# EAGLE schematic LPC11UxxMini (EAGLE 6.3)
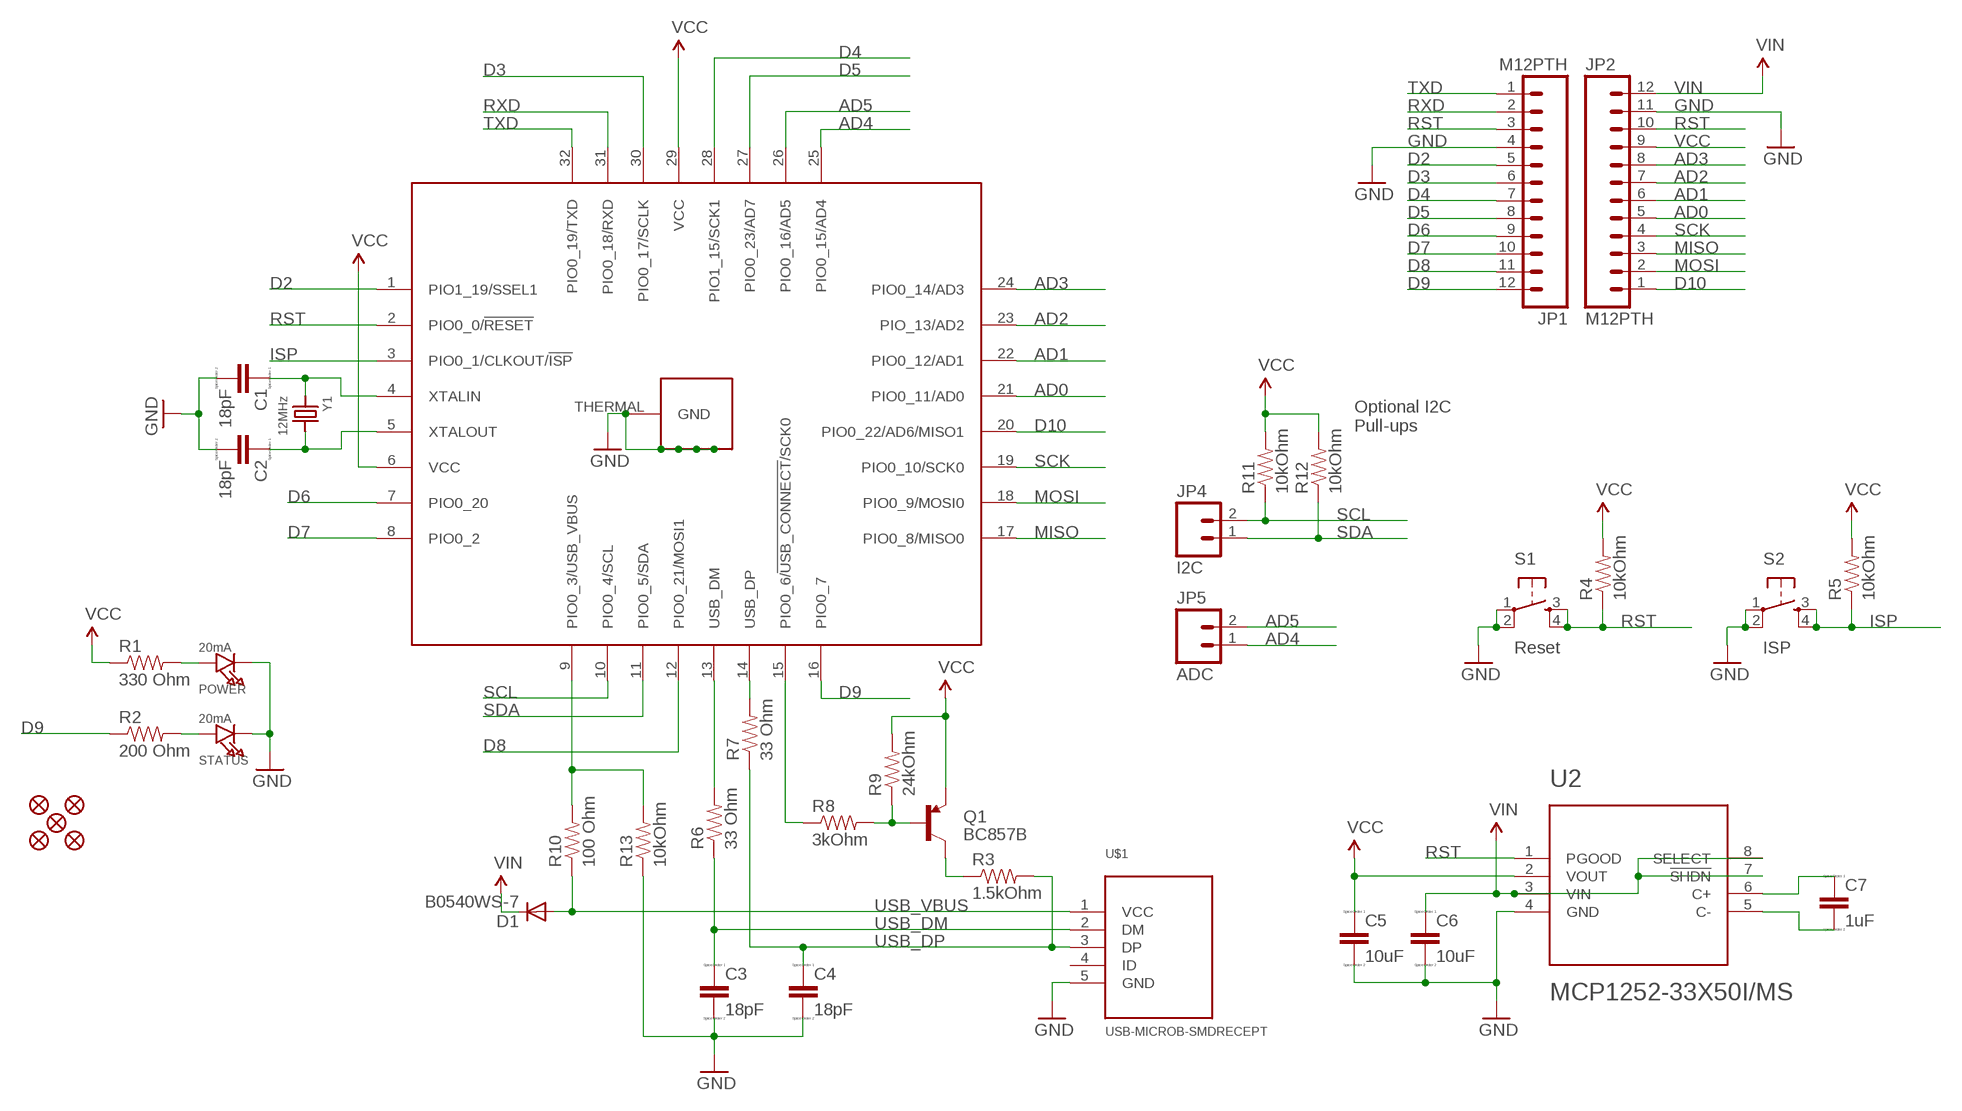
[diagram p0: schematic, sheet 1]

## Parts
C1  18pF  CAP0603-CAP  [0603-CAP]
C2  18pF  CAP0603-CAP  [0603-CAP]
C3  18pF  CAP0603-CAP  [0603-CAP]
C4  18pF  CAP0603-CAP  [0603-CAP]
C5  10uF  CAP1206  [1206]
C6  10uF  CAP1206  [1206]
C7  1uF  CAP0805  [0805]
D1  B0540WS-7  DIODESOD  [SOD-323]
JP1  M12PTH  [1X12]
JP2  M12PTH  [1X12]
JP3  FIDUCIALUFIDUCIAL  [MICRO-FIDUCIAL]
JP4  I2C  M02PTH  [1X02]
JP5  ADC  M02PTH  [1X02]
JP6  FIDUCIALUFIDUCIAL  [MICRO-FIDUCIAL]
JP7  FIDUCIALUFIDUCIAL  [MICRO-FIDUCIAL]
JP8  FIDUCIALUFIDUCIAL  [MICRO-FIDUCIAL]
JP9  FIDUCIALUFIDUCIAL  [MICRO-FIDUCIAL]
POWER  20mA  LED0603_NOOUTLINE  [CHIPLED_0603_NOOUTLINE]
Q1  BC857B  TRANSISTOR_PNPSMD  [SOT23-3]
R1  330 Ohm  RESISTOR0402-RES  [0402-RES]
R2  200 Ohm  RESISTOR0402-RES  [0402-RES]
R3  1.5kOhm  RESISTOR0402-RES  [0402-RES]
R4  10kOhm  RESISTOR0402-RES  [0402-RES]
R5  10kOhm  RESISTOR0402-RES  [0402-RES]
R6  33 Ohm  RESISTOR0402-RES  [0402-RES]
R7  33 Ohm  RESISTOR0402-RES  [0402-RES]
R8  3kOhm  RESISTOR0402-RES  [0402-RES]
R9  24kOhm  RESISTOR0402-RES  [0402-RES]
R10  100 Ohm  RESISTOR0402-RES  [0402-RES]
R11  10kOhm  RESISTOR0402-RES  [0402-RES]
R12  10kOhm  RESISTOR0402-RES  [0402-RES]
R13  10kOhm  RESISTOR0402-RES  [0402-RES]
S1  Reset  TAC_SWITCHSMD  [TACTILE_SWITCH_SMD]
S2  ISP  TAC_SWITCHSMD  [TACTILE_SWITCH_SMD]
STATUS  20mA  LED0603_NOOUTLINE  [CHIPLED_0603_NOOUTLINE]
U1  LPC11Uxx  LPC11U2X-HVQFN33  [HVQFN32-5X5_3MMTHERMAL]
U2  MCP1252-33X50I/MS  MCP1253  [MSOP8_0.65MM]
U$1  USB-MICROB-SMDRECEPT  [USB-MICROB-RECEPT]
Y1  12MHz  CRYSTAL2.5X2.0MM  [CRYSTAL_2.5X2]

## Nets
AD0: JP2.5 U1.21(PIO0_11/AD0)
AD1: JP2.6 U1.22(PIO0_12/AD1)
AD2: JP2.7 U1.23(PIO_13/AD2)
AD3: JP2.8 U1.24(PIO0_14/AD3)
AD4: JP5.1 U1.25(PIO0_15/AD4)
AD5: JP5.2 U1.26(PIO0_16/AD5)
D2: JP1.5 U1.1(PIO1_19/SSEL1)
D3: JP1.6 U1.30(PIO0_17/SCLK)
D4: JP1.7 U1.28(PIO1_15/SCK1)
D5: JP1.8 U1.27(PIO0_23/AD7)
D6: JP1.9 U1.7(PIO0_20)
D7: JP1.10 U1.8(PIO0_2)
D8: JP1.11 U1.12(PIO0_21/MOSI1)
D9: JP1.12 R2.1 U1.16(PIO0_7)
D10: JP2.1 U1.20(PIO0_22/AD6/MISO1)
GND: C1.2 C2.2 C3.2 C4.2 C5.2 C6.2 JP1.4 JP2.11 POWER.C R13.1 S1.1 S1.2 S2.1 S2.2 STATUS.C U1.THERMAL(GND) U1.THERMAL@1(GND) U1.THERMAL@2(GND) U1.THERMAL@3(GND) U1.THERMAL@4(GND) U2.4(GND) U$1.5(GND)
ISP: R5.1 S2.3 S2.4 U1.3(PIO0_1/CLKOUT/!ISP!)
MC_USB_DM: R6.2 U1.13(USB_DM)
MC_USB_DP: R7.2 U1.14(USB_DP)
MC_USB_VBUS: R10.2 R13.2 U1.9(PIO0_3/USB_VBUS)
MISO: JP2.3 U1.17(PIO0_8/MISO0)
MOSI: JP2.2 U1.18(PIO0_9/MOSI0)
POWER_LED_RESISTOR: POWER.A R1.2
PWRREG_C+: C7.1 U2.6(C+)
PWRREG_C-: C7.2 U2.5(C-)
RST: JP1.3 JP2.10 R4.1 S1.3 S1.4 U1.2(PIO0_0/!RESET!) U2.1(PGOOD)
RXD: JP1.2 U1.31(PIO0_18/RXD)
SCK: JP2.4 U1.19(PIO0_10/SCK0)
SCL: JP4.2 R11.1 U1.10(PIO0_4/SCL)
SDA: JP4.1 R12.1 U1.11(PIO0_5/SDA)
STATUS_LED_RESISTOR: R2.2 STATUS.A
TXD: JP1.1 U1.32(PIO0_19/TXD)
USB_CONNECT: R8.1 U1.15(PIO0_6/!USB_CONNECT!/SCK0)
USB_CONNECT_BASE: Q1.1(B) R8.2 R9.1
USB_CONNECT_COLLECTOR: Q1.3(C) R3.1
USB_DM: C3.1 R6.1 U$1.2(DM)
USB_DP: C4.1 R3.2 R7.1 U$1.3(DP)
USB_VBUS: D1.2(A) R10.1 U$1.1(VCC)
VCC: C5.1 JP2.9 Q1.2(E) R1.1 R4.2 R5.2 R9.2 R11.2 R12.2 U1.6(VCC) U1.29(VCC) U2.2(VOUT)
VIN: C6.1 D1.1(C) JP2.12 U2.3(VIN) U2.7(!SHDN) U2.8(SELECT)
XTALIN: C1.1 U1.4(XTALIN) Y1.1
XTALOUT: C2.1 U1.5(XTALOUT) Y1.3
Unconnected: U$1.4(ID)

## Notes on the sheet
- Optional I2C
  Pull-ups

## Library data of the parts
C1-C7 = SparkFun-Capacitors:CAP: Capacitor Standard 0603 ceramic capacitor, and 0.1" leaded capacitor.
D1 = SparkFun-DiscreteSemi:DIODE: Diode These are standard reverse protection diodes and small signal diodes. SMA package can handle up to about 1A. SOD-323 can handle about 200mA. What the SOD-323 package when ordering, there are some mfgs out there that are 5-pin packages.
JP1 JP2 = SparkFun-Connectors:M12: Header 12 Standard 12-pin 0.1" header. Use with straight break away headers (SKU : PRT-00116), right angle break away headers (PRT-00553), swiss pins (PRT-00743), machine pins (PRT-00117), and female headers (PRT-00115).
JP3 JP6-JP9 = SparkFun-Aesthetics:FIDUCIAL: Fiducial Alignment Points Various fiducial points for machine vision alignment.
JP4 JP5 = SparkFun-Connectors:M02: Header 2 Standard 2-pin 0.1" header. Use with straight break away headers (SKU : PRT-00116), right angle break away headers (PRT-00553), swiss pins (PRT-00743), machine pins (PRT-00117), and female headers (PRT-00115). Molex polarized connector foot print use with SKU : PRT-08233 with associated crimp pins and housings.
POWER STATUS = microbuilder:LED: LED 0603 - 0603 Surface Mount Package 2mA: Green LED - Low Power (3.9mcd, 2ma, 1.7Vf) - Digikey: 475-2709-2-ND Orange LED - Low Power (9.8mcd, 2ma, 1.8Vf) - Digikey: 475-1194-2-ND Red LED - Low Power (5mcd, 2ma, 1.8Vf) - Digikey: 475-1195-2-ND Yellow LED - Low Power (7mcd, 2ma, 1.8Vf) - Digikey: 475-1196-2-ND 5mA: Blue LED - Low Power (17mcd, 5ma, 2.9Vf) - Digikey: LNJ937W8CRACT-ND 0805 - 0805 Surface Mount Package 2mA: Red LED (8.8mcd, 2mA, 1.8Vf, Clear) - Low Power [Digikey: 475-2510-1-ND] Green LED (5mcd, 2mA, 1.8Vf, Clear) - Low Power [Digikey: 475-2730-1-ND] Yellow LED (11.3mcd, 2mA, 1.8Vf, Clear) - Low Power [Digikey: 475-2555-1-ND] 20mA: Red LED (104mcd, 20mA, Diffused) - LS R976 [Digikey: 475-1278-6-ND] Red LED (12mcd, 20mA, 2.0Vf, Clear) - APT2012EC [Digikey: 754-1128-1-ND] Green LED (15mcd, 20mA, 2.2Vf, Clear) - APT2012GC [Digikey: 754-1131-1-ND] Orange LED (160mcd, 20mA, 2.1Vf, Clear) - APT2012SECK [Digikey: 754-1130-1-ND] 1206 - 1206 Surface Mount Package Green LED (26mcd, 20mA, Diffused) - LG N971 [Digikey: 475-1407-6-ND] Red LED (15mcd, 20mA, Diffused) - LH N974 [Digikey: 475-1416-6-ND]
Q1 = SparkFun-DiscreteSemi:TRANSISTOR_PNP: Generic PNP BJT. Double check pinouts against datasheets- not all devices are the same!
R1-R13 = SparkFun-Resistors:RESISTOR: Resistor Basic schematic elements and footprints for 0603, 1206, and PTH resistors.
S1 S2 = SparkFun-Electromechanical:TAC_SWITCH: Momentary Switch Button commonly used for reset or general input. Spark Fun Electronics SKU : COM-00097
U1 = logxen:LPC11U2X-HVQFN33
U2 = logxen:MCP1253
U$1 = logxen:USB-MICROB-SMDRECEPT
Y1 = microbuilder:CRYSTAL: Crystals HC49UP - Surface Mount Crystal 4.0MHz 18pF +/-30ppm Surface Mount Crystal [Digikey: 535-9857-1-ND] 12.0 MHz Surface Mount Crystal [Digikey: 535-9869-6-ND] 25.0 MHz Surface Mount Crystal [Digikey: 535-9078-1-ND] 2.5 x 2.0mm - MEMs SMT Crystal 16.0 MHz 10pF 20ppm 2.5 x 2.0mm Crystal [Digikey -40-85°C: 535-10923-1-ND] 3.2 x 2.5mm - MEMs SMT Crystal 12.0 MHz 8pF 15ppm 3.2 x 2.5mm Crystal [Digikey: -10-70°C: 644-1047-1-ND -40-125°C: 644-1128-1-ND] 16.0 MHz 8pF 15ppm 3.2 x 2.5mm Crystal [Digikey: -10-70°C: 644-1049-1-ND -40-125°C: 644-1129-2-ND] 16.0 MHz 10pF 10ppm 3.2 x 2.5mm Crystal [Digikey: 644-1100-1-ND] 27.12 MHz 18pF 30ppm 3.2 x 2.5mm Crystal [Digikey: 887-1424-1-ND] 27.12MHz 10pF 10ppm 3.2 x 2.5mm Crystal [Digikey: 887-1329-1-ND] 4.9 x 1.8mm - MEMs SMT Crystal 32.768 KHz 12.5pF 20ppm 4.9 x 1.8mm Crystal [Digikey: SE2415CT-ND] 8.0 x 3.8mm - Surface Mount Crystal 32.768kHz 12.5pF 20ppm -40°C-85°C [Digikey: 535-9166-2-ND] Cylinder 32.768KHz Cylinder Crystal (2x6mm body) [Ex. Digikey: 300-8341-2-ND]